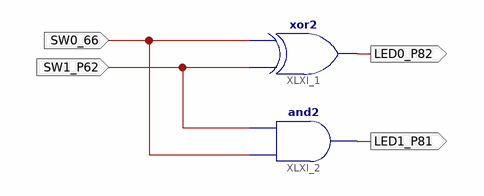
[diagram p0: schematic sheet 1]
// Xilinx ISE schematic halfAdder.sch (spartan6) as structural Verilog: 2 symbols, 4 ports
module halfAdder (
  input  SW0_66,
  input  SW1_P62,
  output LED0_P82,
  output LED1_P81
);

  xor XLXI_1 (LED0_P82, SW1_P62, SW0_66);
  and XLXI_2 (LED1_P81, SW0_66, SW1_P62);
endmodule
